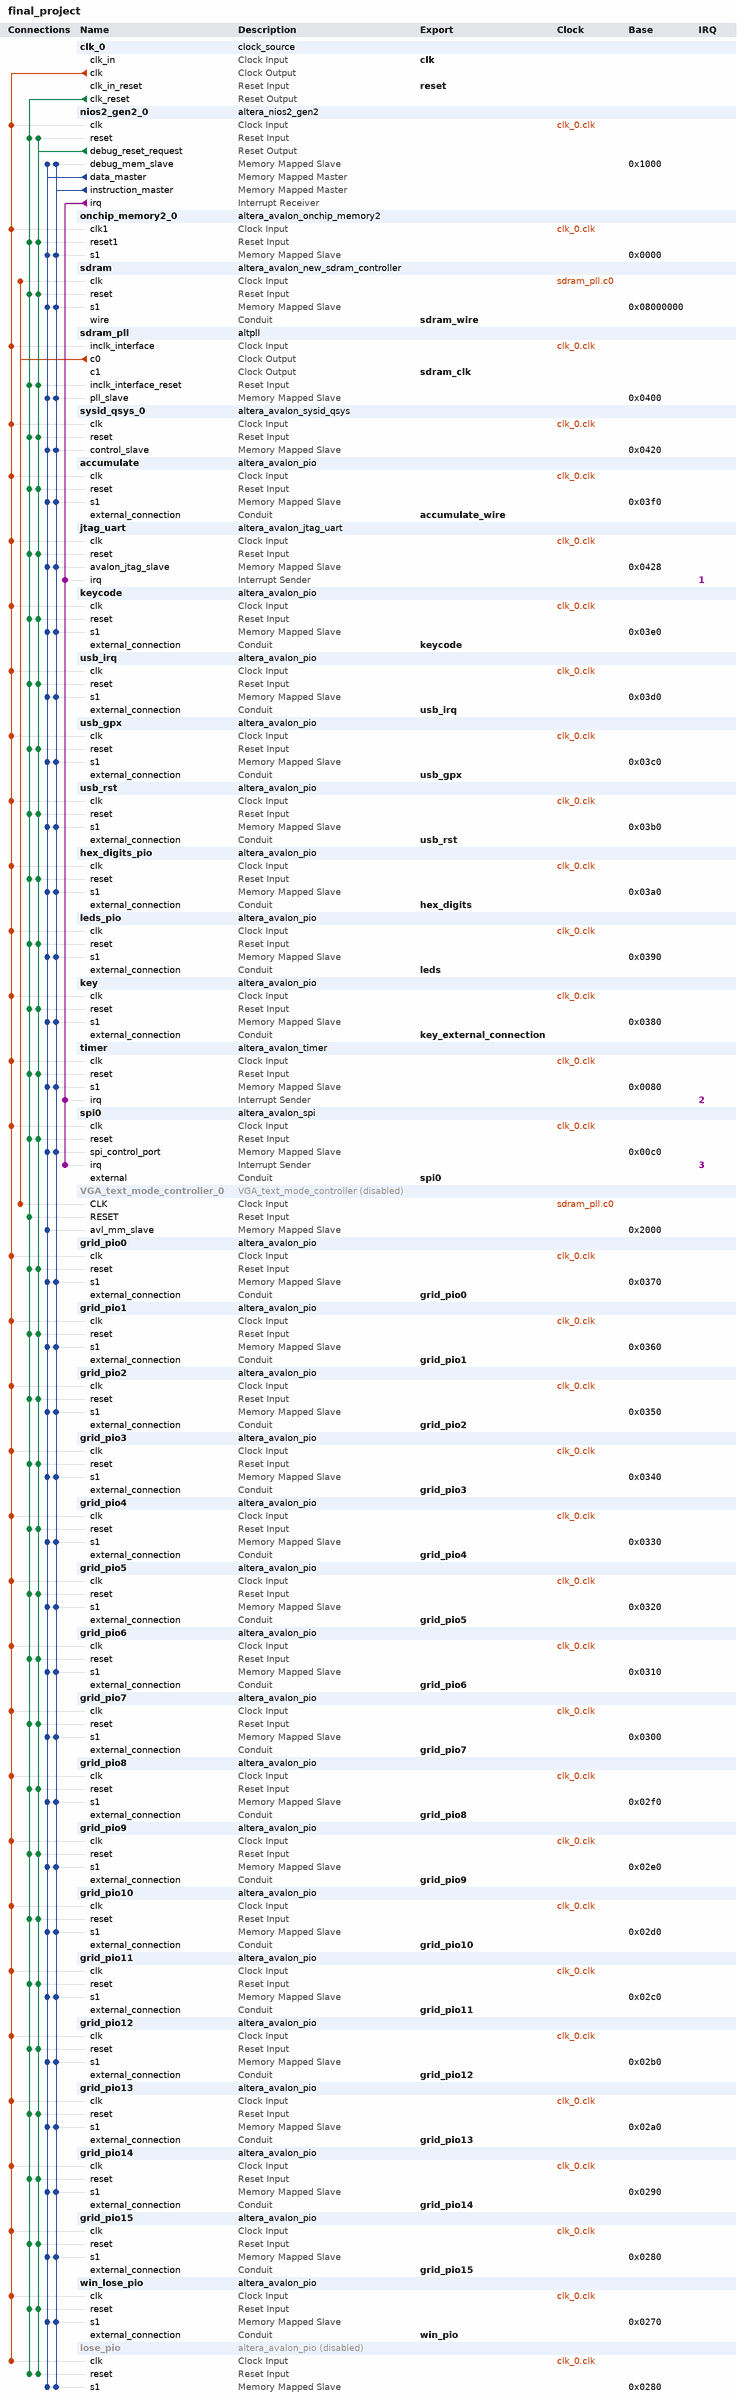
[diagram p0: system contents]
# Platform Designer (Qsys) system final_project, MAX 10 10M50DAF484C7G
# Parameters at their usual value, and those the tool derives, are not listed.
package require -exact qsys 18.1
create_system final_project
set_project_property DEVICE_FAMILY {MAX 10}
set_project_property DEVICE 10M50DAF484C7G

add_instance clk_0 clock_source 18.1
set_instance_parameter_value clk_0 clockFrequency 50000000

add_instance nios2_gen2_0 altera_nios2_gen2 18.1
set_instance_parameter_value nios2_gen2_0 dcache_size 2048
set_instance_parameter_value nios2_gen2_0 exceptionSlave sdram.s1
set_instance_parameter_value nios2_gen2_0 icache_size 4096
set_instance_parameter_value nios2_gen2_0 impl Tiny
set_instance_parameter_value nios2_gen2_0 resetSlave sdram.s1

add_instance onchip_memory2_0 altera_avalon_onchip_memory2 18.1
set_instance_parameter_value onchip_memory2_0 dataWidth 32
set_instance_parameter_value onchip_memory2_0 dualPort false
set_instance_parameter_value onchip_memory2_0 initMemContent true
set_instance_parameter_value onchip_memory2_0 initializationFileName onchip_mem.hex
set_instance_parameter_value onchip_memory2_0 memorySize 16

add_instance sdram altera_avalon_new_sdram_controller 18.1
set_instance_parameter_value sdram TAC 5.4
set_instance_parameter_value sdram TRCD 20.0
set_instance_parameter_value sdram TRP 20.0
set_instance_parameter_value sdram casLatency 3
set_instance_parameter_value sdram columnWidth 10
set_instance_parameter_value sdram dataWidth 16
set_instance_parameter_value sdram generateSimulationModel false
set_instance_parameter_value sdram model single_Micron_MT48LC4M32B2_7_chip
set_instance_parameter_value sdram numberOfBanks 4
set_instance_parameter_value sdram numberOfChipSelects 1
set_instance_parameter_value sdram powerUpDelay 200.0
set_instance_parameter_value sdram refreshPeriod 15.625
set_instance_parameter_value sdram rowWidth 13

add_instance sdram_pll altpll 18.1
set_instance_parameter_value sdram_pll CLK0_DIVIDE_BY 1
set_instance_parameter_value sdram_pll CLK0_MULTIPLY_BY 1
set_instance_parameter_value sdram_pll CLK1_DIVIDE_BY 1
set_instance_parameter_value sdram_pll CLK1_DUTY_CYCLE 50
set_instance_parameter_value sdram_pll CLK1_MULTIPLY_BY 1
set_instance_parameter_value sdram_pll CLK1_PHASE_SHIFT -1000
set_instance_parameter_value sdram_pll INCLK0_INPUT_FREQUENCY 20000
set_instance_parameter_value sdram_pll PORT_ARESET PORT_UNUSED
set_instance_parameter_value sdram_pll PORT_LOCKED PORT_UNUSED
set_instance_parameter_value sdram_pll PORT_clk1 PORT_USED
set_instance_parameter_value sdram_pll PORT_clk2 PORT_UNUSED
set_instance_parameter_value sdram_pll PORT_clk3 PORT_UNUSED

add_instance sysid_qsys_0 altera_avalon_sysid_qsys 18.1
set_instance_parameter_value sysid_qsys_0 id 0

add_instance accumulate altera_avalon_pio 18.1
set_instance_parameter_value accumulate direction Input
set_instance_parameter_value accumulate width 1

add_instance jtag_uart altera_avalon_jtag_uart 18.1
set_instance_parameter_value jtag_uart simInteractiveOptions NO_INTERACTIVE_WINDOWS

add_instance keycode altera_avalon_pio 18.1
set_instance_parameter_value keycode direction Output
set_instance_parameter_value keycode width 8

add_instance usb_irq altera_avalon_pio 18.1
set_instance_parameter_value usb_irq direction Input
set_instance_parameter_value usb_irq width 1

add_instance usb_gpx altera_avalon_pio 18.1
set_instance_parameter_value usb_gpx direction Input
set_instance_parameter_value usb_gpx width 1

add_instance usb_rst altera_avalon_pio 18.1
set_instance_parameter_value usb_rst direction Output
set_instance_parameter_value usb_rst width 1

add_instance hex_digits_pio altera_avalon_pio 18.1
set_instance_parameter_value hex_digits_pio direction Output
set_instance_parameter_value hex_digits_pio width 16

add_instance leds_pio altera_avalon_pio 18.1
set_instance_parameter_value leds_pio direction Output
set_instance_parameter_value leds_pio width 14

add_instance key altera_avalon_pio 18.1
set_instance_parameter_value key direction Input
set_instance_parameter_value key width 2

add_instance timer altera_avalon_timer 18.1
set_instance_parameter_value timer counterSize 64
set_instance_parameter_value timer period 1
set_instance_parameter_value timer periodUnits MSEC

add_instance spi0 altera_avalon_spi 18.1
set_instance_parameter_value spi0 clockPolarity 0
set_instance_parameter_value spi0 dataWidth 8
set_instance_parameter_value spi0 masterSPI true
set_instance_parameter_value spi0 numberOfSlaves 1
set_instance_parameter_value spi0 targetClockRate 2500000

add_instance VGA_text_mode_controller_0 VGA_text_mode_controller 1.0
set_instance_property VGA_text_mode_controller_0 ENABLED false

add_instance grid_pio0 altera_avalon_pio 18.1
set_instance_parameter_value grid_pio0 direction Output
set_instance_parameter_value grid_pio0 width 16

add_instance grid_pio1 altera_avalon_pio 18.1
set_instance_parameter_value grid_pio1 direction Output
set_instance_parameter_value grid_pio1 width 16

add_instance grid_pio2 altera_avalon_pio 18.1
set_instance_parameter_value grid_pio2 direction Output
set_instance_parameter_value grid_pio2 width 16

add_instance grid_pio3 altera_avalon_pio 18.1
set_instance_parameter_value grid_pio3 direction Output
set_instance_parameter_value grid_pio3 width 16

add_instance grid_pio4 altera_avalon_pio 18.1
set_instance_parameter_value grid_pio4 direction Output
set_instance_parameter_value grid_pio4 width 16

add_instance grid_pio5 altera_avalon_pio 18.1
set_instance_parameter_value grid_pio5 direction Output
set_instance_parameter_value grid_pio5 width 16

add_instance grid_pio6 altera_avalon_pio 18.1
set_instance_parameter_value grid_pio6 direction Output
set_instance_parameter_value grid_pio6 width 16

add_instance grid_pio7 altera_avalon_pio 18.1
set_instance_parameter_value grid_pio7 direction Output
set_instance_parameter_value grid_pio7 width 16

add_instance grid_pio8 altera_avalon_pio 18.1
set_instance_parameter_value grid_pio8 direction Output
set_instance_parameter_value grid_pio8 width 16

add_instance grid_pio9 altera_avalon_pio 18.1
set_instance_parameter_value grid_pio9 direction Output
set_instance_parameter_value grid_pio9 width 16

add_instance grid_pio10 altera_avalon_pio 18.1
set_instance_parameter_value grid_pio10 direction Output
set_instance_parameter_value grid_pio10 width 16

add_instance grid_pio11 altera_avalon_pio 18.1
set_instance_parameter_value grid_pio11 direction Output
set_instance_parameter_value grid_pio11 width 16

add_instance grid_pio12 altera_avalon_pio 18.1
set_instance_parameter_value grid_pio12 direction Output
set_instance_parameter_value grid_pio12 width 16

add_instance grid_pio13 altera_avalon_pio 18.1
set_instance_parameter_value grid_pio13 direction Output
set_instance_parameter_value grid_pio13 width 16

add_instance grid_pio14 altera_avalon_pio 18.1
set_instance_parameter_value grid_pio14 direction Output
set_instance_parameter_value grid_pio14 width 16

add_instance grid_pio15 altera_avalon_pio 18.1
set_instance_parameter_value grid_pio15 direction Output
set_instance_parameter_value grid_pio15 width 16

add_instance win_lose_pio altera_avalon_pio 18.1
set_instance_parameter_value win_lose_pio direction Output
set_instance_parameter_value win_lose_pio width 2

add_instance lose_pio altera_avalon_pio 18.1
set_instance_property lose_pio ENABLED false
set_instance_parameter_value lose_pio direction Output
set_instance_parameter_value lose_pio width 1

# connections
add_connection clk_0.clk accumulate.clk clock
add_connection clk_0.clk grid_pio0.clk clock
add_connection clk_0.clk grid_pio1.clk clock
add_connection clk_0.clk grid_pio2.clk clock
add_connection clk_0.clk grid_pio3.clk clock
add_connection clk_0.clk grid_pio4.clk clock
add_connection clk_0.clk grid_pio5.clk clock
add_connection clk_0.clk grid_pio6.clk clock
add_connection clk_0.clk grid_pio7.clk clock
add_connection clk_0.clk grid_pio8.clk clock
add_connection clk_0.clk grid_pio9.clk clock
add_connection clk_0.clk grid_pio10.clk clock
add_connection clk_0.clk grid_pio11.clk clock
add_connection clk_0.clk grid_pio12.clk clock
add_connection clk_0.clk grid_pio13.clk clock
add_connection clk_0.clk grid_pio14.clk clock
add_connection clk_0.clk grid_pio15.clk clock
add_connection clk_0.clk hex_digits_pio.clk clock
add_connection clk_0.clk jtag_uart.clk clock
add_connection clk_0.clk key.clk clock
add_connection clk_0.clk keycode.clk clock
add_connection clk_0.clk leds_pio.clk clock
add_connection clk_0.clk lose_pio.clk clock
add_connection clk_0.clk nios2_gen2_0.clk clock
add_connection clk_0.clk onchip_memory2_0.clk1 clock
add_connection clk_0.clk sdram_pll.inclk_interface clock
add_connection clk_0.clk spi0.clk clock
add_connection clk_0.clk sysid_qsys_0.clk clock
add_connection clk_0.clk timer.clk clock
add_connection clk_0.clk usb_gpx.clk clock
add_connection clk_0.clk usb_irq.clk clock
add_connection clk_0.clk usb_rst.clk clock
add_connection clk_0.clk win_lose_pio.clk clock
add_connection sdram_pll.c0 sdram.clk clock
add_connection sdram_pll.c0 VGA_text_mode_controller_0.CLK clock
add_connection clk_0.clk_reset accumulate.reset reset
add_connection clk_0.clk_reset grid_pio0.reset reset
add_connection clk_0.clk_reset grid_pio1.reset reset
add_connection clk_0.clk_reset grid_pio2.reset reset
add_connection clk_0.clk_reset grid_pio3.reset reset
add_connection clk_0.clk_reset grid_pio4.reset reset
add_connection clk_0.clk_reset grid_pio5.reset reset
add_connection clk_0.clk_reset grid_pio6.reset reset
add_connection clk_0.clk_reset grid_pio7.reset reset
add_connection clk_0.clk_reset grid_pio8.reset reset
add_connection clk_0.clk_reset grid_pio9.reset reset
add_connection clk_0.clk_reset grid_pio10.reset reset
add_connection clk_0.clk_reset grid_pio11.reset reset
add_connection clk_0.clk_reset grid_pio12.reset reset
add_connection clk_0.clk_reset grid_pio13.reset reset
add_connection clk_0.clk_reset grid_pio14.reset reset
add_connection clk_0.clk_reset grid_pio15.reset reset
add_connection clk_0.clk_reset hex_digits_pio.reset reset
add_connection clk_0.clk_reset jtag_uart.reset reset
add_connection clk_0.clk_reset key.reset reset
add_connection clk_0.clk_reset keycode.reset reset
add_connection clk_0.clk_reset leds_pio.reset reset
add_connection clk_0.clk_reset lose_pio.reset reset
add_connection clk_0.clk_reset nios2_gen2_0.reset reset
add_connection clk_0.clk_reset onchip_memory2_0.reset1 reset
add_connection clk_0.clk_reset sdram.reset reset
add_connection clk_0.clk_reset sdram_pll.inclk_interface_reset reset
add_connection clk_0.clk_reset spi0.reset reset
add_connection clk_0.clk_reset sysid_qsys_0.reset reset
add_connection clk_0.clk_reset timer.reset reset
add_connection clk_0.clk_reset usb_gpx.reset reset
add_connection clk_0.clk_reset usb_irq.reset reset
add_connection clk_0.clk_reset usb_rst.reset reset
add_connection clk_0.clk_reset VGA_text_mode_controller_0.RESET reset
add_connection clk_0.clk_reset win_lose_pio.reset reset
add_connection nios2_gen2_0.debug_reset_request accumulate.reset reset
add_connection nios2_gen2_0.debug_reset_request grid_pio0.reset reset
add_connection nios2_gen2_0.debug_reset_request grid_pio1.reset reset
add_connection nios2_gen2_0.debug_reset_request grid_pio2.reset reset
add_connection nios2_gen2_0.debug_reset_request grid_pio3.reset reset
add_connection nios2_gen2_0.debug_reset_request grid_pio4.reset reset
add_connection nios2_gen2_0.debug_reset_request grid_pio5.reset reset
add_connection nios2_gen2_0.debug_reset_request grid_pio6.reset reset
add_connection nios2_gen2_0.debug_reset_request grid_pio7.reset reset
add_connection nios2_gen2_0.debug_reset_request grid_pio8.reset reset
add_connection nios2_gen2_0.debug_reset_request grid_pio9.reset reset
add_connection nios2_gen2_0.debug_reset_request grid_pio10.reset reset
add_connection nios2_gen2_0.debug_reset_request grid_pio11.reset reset
add_connection nios2_gen2_0.debug_reset_request grid_pio12.reset reset
add_connection nios2_gen2_0.debug_reset_request grid_pio13.reset reset
add_connection nios2_gen2_0.debug_reset_request grid_pio14.reset reset
add_connection nios2_gen2_0.debug_reset_request grid_pio15.reset reset
add_connection nios2_gen2_0.debug_reset_request hex_digits_pio.reset reset
add_connection nios2_gen2_0.debug_reset_request jtag_uart.reset reset
add_connection nios2_gen2_0.debug_reset_request key.reset reset
add_connection nios2_gen2_0.debug_reset_request keycode.reset reset
add_connection nios2_gen2_0.debug_reset_request leds_pio.reset reset
add_connection nios2_gen2_0.debug_reset_request lose_pio.reset reset
add_connection nios2_gen2_0.debug_reset_request nios2_gen2_0.reset reset
add_connection nios2_gen2_0.debug_reset_request onchip_memory2_0.reset1 reset
add_connection nios2_gen2_0.debug_reset_request sdram.reset reset
add_connection nios2_gen2_0.debug_reset_request sdram_pll.inclk_interface_reset reset
add_connection nios2_gen2_0.debug_reset_request spi0.reset reset
add_connection nios2_gen2_0.debug_reset_request sysid_qsys_0.reset reset
add_connection nios2_gen2_0.debug_reset_request timer.reset reset
add_connection nios2_gen2_0.debug_reset_request usb_gpx.reset reset
add_connection nios2_gen2_0.debug_reset_request usb_irq.reset reset
add_connection nios2_gen2_0.debug_reset_request usb_rst.reset reset
add_connection nios2_gen2_0.debug_reset_request win_lose_pio.reset reset
add_connection nios2_gen2_0.data_master accumulate.s1 avalon
set_connection_parameter_value nios2_gen2_0.data_master/accumulate.s1 baseAddress 0x03f0
add_connection nios2_gen2_0.data_master grid_pio0.s1 avalon
set_connection_parameter_value nios2_gen2_0.data_master/grid_pio0.s1 baseAddress 0x0370
add_connection nios2_gen2_0.data_master grid_pio1.s1 avalon
set_connection_parameter_value nios2_gen2_0.data_master/grid_pio1.s1 baseAddress 0x0360
add_connection nios2_gen2_0.data_master grid_pio2.s1 avalon
set_connection_parameter_value nios2_gen2_0.data_master/grid_pio2.s1 baseAddress 0x0350
add_connection nios2_gen2_0.data_master grid_pio3.s1 avalon
set_connection_parameter_value nios2_gen2_0.data_master/grid_pio3.s1 baseAddress 0x0340
add_connection nios2_gen2_0.data_master grid_pio4.s1 avalon
set_connection_parameter_value nios2_gen2_0.data_master/grid_pio4.s1 baseAddress 0x0330
add_connection nios2_gen2_0.data_master grid_pio5.s1 avalon
set_connection_parameter_value nios2_gen2_0.data_master/grid_pio5.s1 baseAddress 0x0320
add_connection nios2_gen2_0.data_master grid_pio6.s1 avalon
set_connection_parameter_value nios2_gen2_0.data_master/grid_pio6.s1 baseAddress 0x0310
add_connection nios2_gen2_0.data_master grid_pio7.s1 avalon
set_connection_parameter_value nios2_gen2_0.data_master/grid_pio7.s1 baseAddress 0x0300
add_connection nios2_gen2_0.data_master grid_pio8.s1 avalon
set_connection_parameter_value nios2_gen2_0.data_master/grid_pio8.s1 baseAddress 0x02f0
add_connection nios2_gen2_0.data_master grid_pio9.s1 avalon
set_connection_parameter_value nios2_gen2_0.data_master/grid_pio9.s1 baseAddress 0x02e0
add_connection nios2_gen2_0.data_master grid_pio10.s1 avalon
set_connection_parameter_value nios2_gen2_0.data_master/grid_pio10.s1 baseAddress 0x02d0
add_connection nios2_gen2_0.data_master grid_pio11.s1 avalon
set_connection_parameter_value nios2_gen2_0.data_master/grid_pio11.s1 baseAddress 0x02c0
add_connection nios2_gen2_0.data_master grid_pio12.s1 avalon
set_connection_parameter_value nios2_gen2_0.data_master/grid_pio12.s1 baseAddress 0x02b0
add_connection nios2_gen2_0.data_master grid_pio13.s1 avalon
set_connection_parameter_value nios2_gen2_0.data_master/grid_pio13.s1 baseAddress 0x02a0
add_connection nios2_gen2_0.data_master grid_pio14.s1 avalon
set_connection_parameter_value nios2_gen2_0.data_master/grid_pio14.s1 baseAddress 0x0290
add_connection nios2_gen2_0.data_master grid_pio15.s1 avalon
set_connection_parameter_value nios2_gen2_0.data_master/grid_pio15.s1 baseAddress 0x0280
add_connection nios2_gen2_0.data_master hex_digits_pio.s1 avalon
set_connection_parameter_value nios2_gen2_0.data_master/hex_digits_pio.s1 baseAddress 0x03a0
add_connection nios2_gen2_0.data_master jtag_uart.avalon_jtag_slave avalon
set_connection_parameter_value nios2_gen2_0.data_master/jtag_uart.avalon_jtag_slave baseAddress 0x0428
add_connection nios2_gen2_0.data_master key.s1 avalon
set_connection_parameter_value nios2_gen2_0.data_master/key.s1 baseAddress 0x0380
add_connection nios2_gen2_0.data_master keycode.s1 avalon
set_connection_parameter_value nios2_gen2_0.data_master/keycode.s1 baseAddress 0x03e0
add_connection nios2_gen2_0.data_master leds_pio.s1 avalon
set_connection_parameter_value nios2_gen2_0.data_master/leds_pio.s1 baseAddress 0x0390
add_connection nios2_gen2_0.data_master lose_pio.s1 avalon
set_connection_parameter_value nios2_gen2_0.data_master/lose_pio.s1 baseAddress 0x0280
add_connection nios2_gen2_0.data_master nios2_gen2_0.debug_mem_slave avalon
set_connection_parameter_value nios2_gen2_0.data_master/nios2_gen2_0.debug_mem_slave baseAddress 0x1000
add_connection nios2_gen2_0.data_master onchip_memory2_0.s1 avalon
set_connection_parameter_value nios2_gen2_0.data_master/onchip_memory2_0.s1 baseAddress 0x0000
add_connection nios2_gen2_0.data_master sdram.s1 avalon
set_connection_parameter_value nios2_gen2_0.data_master/sdram.s1 baseAddress 0x08000000
add_connection nios2_gen2_0.data_master sdram_pll.pll_slave avalon
set_connection_parameter_value nios2_gen2_0.data_master/sdram_pll.pll_slave baseAddress 0x0400
add_connection nios2_gen2_0.data_master spi0.spi_control_port avalon
set_connection_parameter_value nios2_gen2_0.data_master/spi0.spi_control_port baseAddress 0x00c0
add_connection nios2_gen2_0.data_master sysid_qsys_0.control_slave avalon
set_connection_parameter_value nios2_gen2_0.data_master/sysid_qsys_0.control_slave baseAddress 0x0420
add_connection nios2_gen2_0.data_master timer.s1 avalon
set_connection_parameter_value nios2_gen2_0.data_master/timer.s1 baseAddress 0x0080
add_connection nios2_gen2_0.data_master usb_gpx.s1 avalon
set_connection_parameter_value nios2_gen2_0.data_master/usb_gpx.s1 baseAddress 0x03c0
add_connection nios2_gen2_0.data_master usb_irq.s1 avalon
set_connection_parameter_value nios2_gen2_0.data_master/usb_irq.s1 baseAddress 0x03d0
add_connection nios2_gen2_0.data_master usb_rst.s1 avalon
set_connection_parameter_value nios2_gen2_0.data_master/usb_rst.s1 baseAddress 0x03b0
add_connection nios2_gen2_0.data_master VGA_text_mode_controller_0.avl_mm_slave avalon
set_connection_parameter_value nios2_gen2_0.data_master/VGA_text_mode_controller_0.avl_mm_slave baseAddress 0x2000
add_connection nios2_gen2_0.data_master win_lose_pio.s1 avalon
set_connection_parameter_value nios2_gen2_0.data_master/win_lose_pio.s1 baseAddress 0x0270
add_connection nios2_gen2_0.instruction_master accumulate.s1 avalon
set_connection_parameter_value nios2_gen2_0.instruction_master/accumulate.s1 baseAddress 0x03f0
add_connection nios2_gen2_0.instruction_master grid_pio0.s1 avalon
set_connection_parameter_value nios2_gen2_0.instruction_master/grid_pio0.s1 baseAddress 0x0370
add_connection nios2_gen2_0.instruction_master grid_pio1.s1 avalon
set_connection_parameter_value nios2_gen2_0.instruction_master/grid_pio1.s1 baseAddress 0x0360
add_connection nios2_gen2_0.instruction_master grid_pio2.s1 avalon
set_connection_parameter_value nios2_gen2_0.instruction_master/grid_pio2.s1 baseAddress 0x0350
add_connection nios2_gen2_0.instruction_master grid_pio3.s1 avalon
set_connection_parameter_value nios2_gen2_0.instruction_master/grid_pio3.s1 baseAddress 0x0340
add_connection nios2_gen2_0.instruction_master grid_pio4.s1 avalon
set_connection_parameter_value nios2_gen2_0.instruction_master/grid_pio4.s1 baseAddress 0x0330
add_connection nios2_gen2_0.instruction_master grid_pio5.s1 avalon
set_connection_parameter_value nios2_gen2_0.instruction_master/grid_pio5.s1 baseAddress 0x0320
add_connection nios2_gen2_0.instruction_master grid_pio6.s1 avalon
set_connection_parameter_value nios2_gen2_0.instruction_master/grid_pio6.s1 baseAddress 0x0310
add_connection nios2_gen2_0.instruction_master grid_pio7.s1 avalon
set_connection_parameter_value nios2_gen2_0.instruction_master/grid_pio7.s1 baseAddress 0x0300
add_connection nios2_gen2_0.instruction_master grid_pio8.s1 avalon
set_connection_parameter_value nios2_gen2_0.instruction_master/grid_pio8.s1 baseAddress 0x02f0
add_connection nios2_gen2_0.instruction_master grid_pio9.s1 avalon
set_connection_parameter_value nios2_gen2_0.instruction_master/grid_pio9.s1 baseAddress 0x02e0
add_connection nios2_gen2_0.instruction_master grid_pio10.s1 avalon
set_connection_parameter_value nios2_gen2_0.instruction_master/grid_pio10.s1 baseAddress 0x02d0
add_connection nios2_gen2_0.instruction_master grid_pio11.s1 avalon
set_connection_parameter_value nios2_gen2_0.instruction_master/grid_pio11.s1 baseAddress 0x02c0
add_connection nios2_gen2_0.instruction_master grid_pio12.s1 avalon
set_connection_parameter_value nios2_gen2_0.instruction_master/grid_pio12.s1 baseAddress 0x02b0
add_connection nios2_gen2_0.instruction_master grid_pio13.s1 avalon
set_connection_parameter_value nios2_gen2_0.instruction_master/grid_pio13.s1 baseAddress 0x02a0
add_connection nios2_gen2_0.instruction_master grid_pio14.s1 avalon
set_connection_parameter_value nios2_gen2_0.instruction_master/grid_pio14.s1 baseAddress 0x0290
add_connection nios2_gen2_0.instruction_master grid_pio15.s1 avalon
set_connection_parameter_value nios2_gen2_0.instruction_master/grid_pio15.s1 baseAddress 0x0280
add_connection nios2_gen2_0.instruction_master hex_digits_pio.s1 avalon
set_connection_parameter_value nios2_gen2_0.instruction_master/hex_digits_pio.s1 baseAddress 0x03a0
add_connection nios2_gen2_0.instruction_master jtag_uart.avalon_jtag_slave avalon
set_connection_parameter_value nios2_gen2_0.instruction_master/jtag_uart.avalon_jtag_slave baseAddress 0x0428
add_connection nios2_gen2_0.instruction_master key.s1 avalon
set_connection_parameter_value nios2_gen2_0.instruction_master/key.s1 baseAddress 0x0380
add_connection nios2_gen2_0.instruction_master keycode.s1 avalon
set_connection_parameter_value nios2_gen2_0.instruction_master/keycode.s1 baseAddress 0x03e0
add_connection nios2_gen2_0.instruction_master leds_pio.s1 avalon
set_connection_parameter_value nios2_gen2_0.instruction_master/leds_pio.s1 baseAddress 0x0390
add_connection nios2_gen2_0.instruction_master lose_pio.s1 avalon
set_connection_parameter_value nios2_gen2_0.instruction_master/lose_pio.s1 baseAddress 0x0280
add_connection nios2_gen2_0.instruction_master nios2_gen2_0.debug_mem_slave avalon
set_connection_parameter_value nios2_gen2_0.instruction_master/nios2_gen2_0.debug_mem_slave baseAddress 0x1000
add_connection nios2_gen2_0.instruction_master onchip_memory2_0.s1 avalon
set_connection_parameter_value nios2_gen2_0.instruction_master/onchip_memory2_0.s1 baseAddress 0x0000
add_connection nios2_gen2_0.instruction_master sdram.s1 avalon
set_connection_parameter_value nios2_gen2_0.instruction_master/sdram.s1 baseAddress 0x08000000
add_connection nios2_gen2_0.instruction_master sdram_pll.pll_slave avalon
set_connection_parameter_value nios2_gen2_0.instruction_master/sdram_pll.pll_slave baseAddress 0x0400
add_connection nios2_gen2_0.instruction_master spi0.spi_control_port avalon
set_connection_parameter_value nios2_gen2_0.instruction_master/spi0.spi_control_port baseAddress 0x00c0
add_connection nios2_gen2_0.instruction_master sysid_qsys_0.control_slave avalon
set_connection_parameter_value nios2_gen2_0.instruction_master/sysid_qsys_0.control_slave baseAddress 0x0420
add_connection nios2_gen2_0.instruction_master timer.s1 avalon
set_connection_parameter_value nios2_gen2_0.instruction_master/timer.s1 baseAddress 0x0080
add_connection nios2_gen2_0.instruction_master usb_gpx.s1 avalon
set_connection_parameter_value nios2_gen2_0.instruction_master/usb_gpx.s1 baseAddress 0x03c0
add_connection nios2_gen2_0.instruction_master usb_irq.s1 avalon
set_connection_parameter_value nios2_gen2_0.instruction_master/usb_irq.s1 baseAddress 0x03d0
add_connection nios2_gen2_0.instruction_master usb_rst.s1 avalon
set_connection_parameter_value nios2_gen2_0.instruction_master/usb_rst.s1 baseAddress 0x03b0
add_connection nios2_gen2_0.instruction_master win_lose_pio.s1 avalon
set_connection_parameter_value nios2_gen2_0.instruction_master/win_lose_pio.s1 baseAddress 0x0270
add_connection nios2_gen2_0.irq jtag_uart.irq interrupt
set_connection_parameter_value nios2_gen2_0.irq/jtag_uart.irq irqNumber 1
add_connection nios2_gen2_0.irq spi0.irq interrupt
set_connection_parameter_value nios2_gen2_0.irq/spi0.irq irqNumber 3
add_connection nios2_gen2_0.irq timer.irq interrupt
set_connection_parameter_value nios2_gen2_0.irq/timer.irq irqNumber 2

# exported interfaces
add_interface accumulate_wire conduit end
set_interface_property accumulate_wire EXPORT_OF accumulate.external_connection
add_interface clk clock sink
set_interface_property clk EXPORT_OF clk_0.clk_in
add_interface grid_pio0 conduit end
set_interface_property grid_pio0 EXPORT_OF grid_pio0.external_connection
add_interface grid_pio1 conduit end
set_interface_property grid_pio1 EXPORT_OF grid_pio1.external_connection
add_interface grid_pio10 conduit end
set_interface_property grid_pio10 EXPORT_OF grid_pio10.external_connection
add_interface grid_pio11 conduit end
set_interface_property grid_pio11 EXPORT_OF grid_pio11.external_connection
add_interface grid_pio12 conduit end
set_interface_property grid_pio12 EXPORT_OF grid_pio12.external_connection
add_interface grid_pio13 conduit end
set_interface_property grid_pio13 EXPORT_OF grid_pio13.external_connection
add_interface grid_pio14 conduit end
set_interface_property grid_pio14 EXPORT_OF grid_pio14.external_connection
add_interface grid_pio15 conduit end
set_interface_property grid_pio15 EXPORT_OF grid_pio15.external_connection
add_interface grid_pio2 conduit end
set_interface_property grid_pio2 EXPORT_OF grid_pio2.external_connection
add_interface grid_pio3 conduit end
set_interface_property grid_pio3 EXPORT_OF grid_pio3.external_connection
add_interface grid_pio4 conduit end
set_interface_property grid_pio4 EXPORT_OF grid_pio4.external_connection
add_interface grid_pio5 conduit end
set_interface_property grid_pio5 EXPORT_OF grid_pio5.external_connection
add_interface grid_pio6 conduit end
set_interface_property grid_pio6 EXPORT_OF grid_pio6.external_connection
add_interface grid_pio7 conduit end
set_interface_property grid_pio7 EXPORT_OF grid_pio7.external_connection
add_interface grid_pio8 conduit end
set_interface_property grid_pio8 EXPORT_OF grid_pio8.external_connection
add_interface grid_pio9 conduit end
set_interface_property grid_pio9 EXPORT_OF grid_pio9.external_connection
add_interface hex_digits conduit end
set_interface_property hex_digits EXPORT_OF hex_digits_pio.external_connection
add_interface key_external_connection conduit end
set_interface_property key_external_connection EXPORT_OF key.external_connection
add_interface keycode conduit end
set_interface_property keycode EXPORT_OF keycode.external_connection
add_interface leds conduit end
set_interface_property leds EXPORT_OF leds_pio.external_connection
add_interface reset reset sink
set_interface_property reset EXPORT_OF clk_0.clk_in_reset
add_interface sdram_clk clock source
set_interface_property sdram_clk EXPORT_OF sdram_pll.c1
add_interface sdram_wire conduit end
set_interface_property sdram_wire EXPORT_OF sdram.wire
add_interface spi0 conduit end
set_interface_property spi0 EXPORT_OF spi0.external
add_interface usb_gpx conduit end
set_interface_property usb_gpx EXPORT_OF usb_gpx.external_connection
add_interface usb_irq conduit end
set_interface_property usb_irq EXPORT_OF usb_irq.external_connection
add_interface usb_rst conduit end
set_interface_property usb_rst EXPORT_OF usb_rst.external_connection
add_interface win_pio conduit end
set_interface_property win_pio EXPORT_OF win_lose_pio.external_connection

set_interconnect_requirement {$system} qsys_mm.clockCrossingAdapter HANDSHAKE
set_interconnect_requirement {$system} qsys_mm.enableEccProtection FALSE
set_interconnect_requirement {$system} qsys_mm.insertDefaultSlave FALSE
set_interconnect_requirement {$system} qsys_mm.maxAdditionalLatency 1

save_system final_project.qsys
